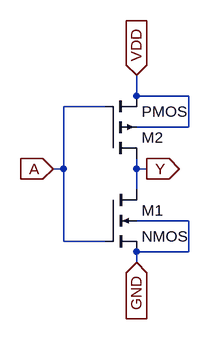
[diagram p0: schematic NOT_SYM.asc]
NOT_SYM.asc, the LTspice schematic file:
Version 4
SHEET 1 880 680
WIRE 208 32 208 0
WIRE 288 32 208 32
WIRE 160 48 96 48
WIRE 288 80 288 32
WIRE 288 80 208 80
WIRE 96 144 96 48
WIRE 96 144 80 144
WIRE 208 144 208 128
WIRE 224 144 208 144
WIRE 208 176 208 144
WIRE 288 224 208 224
WIRE 96 256 96 144
WIRE 160 256 96 256
WIRE 288 272 288 224
WIRE 288 272 208 272
WIRE 208 288 208 272
FLAG 80 144 A
IOPIN 80 144 In
FLAG 208 0 VDD
IOPIN 208 0 In
FLAG 208 288 GND
IOPIN 208 288 In
FLAG 224 144 Y
IOPIN 224 144 Out
SYMBOL nmos4 160 176 R0
SYMATTR InstName M1
SYMBOL pmos4 160 128 M180
SYMATTR InstName M2

The netlist it stands for:
* NOT_SYM.asc
M1 Y A GND GND NMOS
M2 Y A VDD VDD PMOS
.model NMOS NMOS
.model PMOS PMOS
.lib standard.mos
.backanno
.end